# EAGLE schematic sensor (EAGLE 9.2.2)
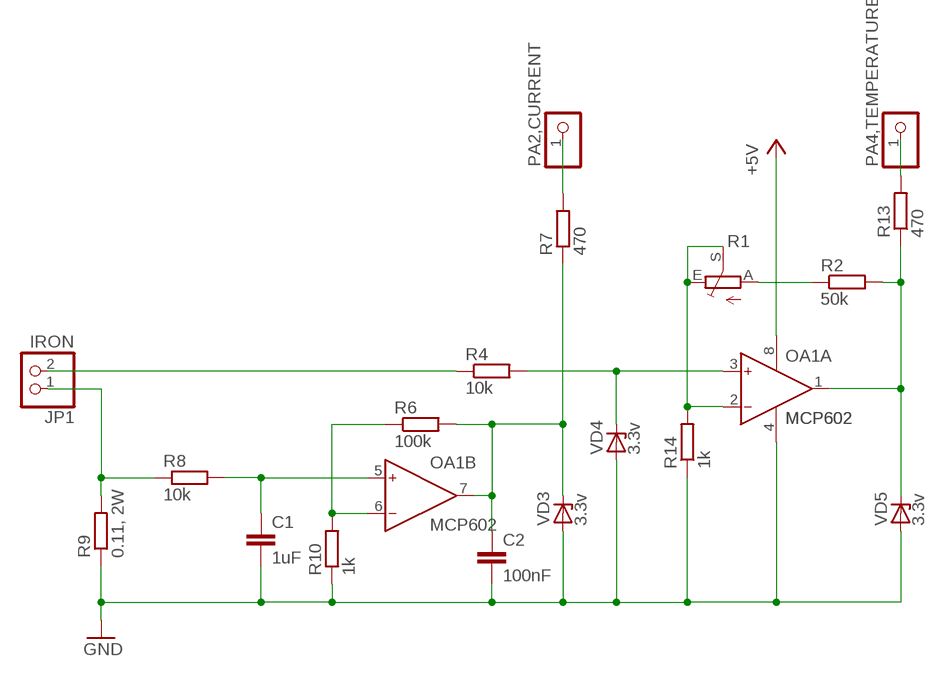
[diagram p0: schematic, sheet 1]

## Parts
C1  1uF  C-EU025-024X044  [C025-024X044]
C2  100nF  C-EU025-024X044  [C025-024X044]
JP1  IRON  PINHD-1X2  [1X02]
OA1  MCP602  AD822N  [DIL08]
PA2,CURRENT  PINHD-1X1  [1X01]
PA4,TEMPERATURE  PINHD-1X1  [1X01]
R1  TRIM_EU-B64Y  [B64Y]
R2  50k  R-EU_0204/5  [0204/5]
R4  10k  R-EU_0204/5  [0204/5]
R6  100k  R-EU_0204/5  [0204/5]
R7  470  R-EU_0204/5  [0204/5]
R8  10k  R-EU_0204/5  [0204/5]
R9  0.11, 2W  R-EU_0204/5  [0204/5]
R10  1k  R-EU_0204/5  [0204/5]
R13  470  R-EU_0204/5  [0204/5]
R14  1k  R-EU_0204/5  [0204/5]
VD3  3.3v  ZENER-DIODEC1702-15  [C1702-15]
VD4  3.3v  ZENER-DIODEC1702-15  [C1702-15]
VD5  3.3v  ZENER-DIODEC1702-15  [C1702-15]

## Nets
+5V: OA1.8(P:V+)
GND: C1.2 C2.2 OA1.4(P:V-) R9.1 R10.1 R14.1 VD3.A VD4.A VD5.A
N$1: JP1.1 R8.1 R9.2
N$2: C1.1 OA1.5(B:IN+) R8.2
N$3: OA1.6(B:IN-) R6.1 R10.2
N$4: C2.1 OA1.7(B:OUT) R6.2 R7.1 VD3.C
N$5: OA1.3(A:IN+) R4.2 VD4.C
N$6: OA1.2(A:IN-) R1.E R1.S R14.2
N$7: JP1.2 R4.1
N$8: PA2,CURRENT.1 R7.2
N$9: PA4,TEMPERATURE.1 R13.2
N$10: R1.A R2.1
N$11: OA1.1(A:OUT) R2.2 R13.1 VD5.C

## Library data of the parts
C1 C2 = rcl:C-EU: CAPACITOR, European symbol; SPICEPREFIX: C
JP1 = pinhead:PINHD-1X2: PIN HEADER
OA1 = analog-devices:AD822: Single-Supply, Rail-to-Rail Low Power FET-Input Op Amp Source: http://www.analog.com/static/imported-files/data_sheets/AD822.pdf; OC_FARNELL: 1438581; OC_NEWARK: unknown
PA2,CURRENT PA4,TEMPERATURE = pinhead:PINHD-1X1: PIN HEADER
R1 = pot:TRIM_EU-: POTENTIOMETER
R2 R4 R6-R10 R13 R14 = rcl:R-EU_: RESISTOR, European symbol; SPICEPREFIX: R
VD3-VD5 = diode:ZENER-DIODE: Z-Diode